# Altium schematic sheet Power (Bridge Rectifier).SchDoc: Bridge Rectifier
size A4; DrawnBy: Mauro De Bruyn; Revision: 1; SheetNumber: 5; SheetTotal: 5; Number: PXL EAI1_2
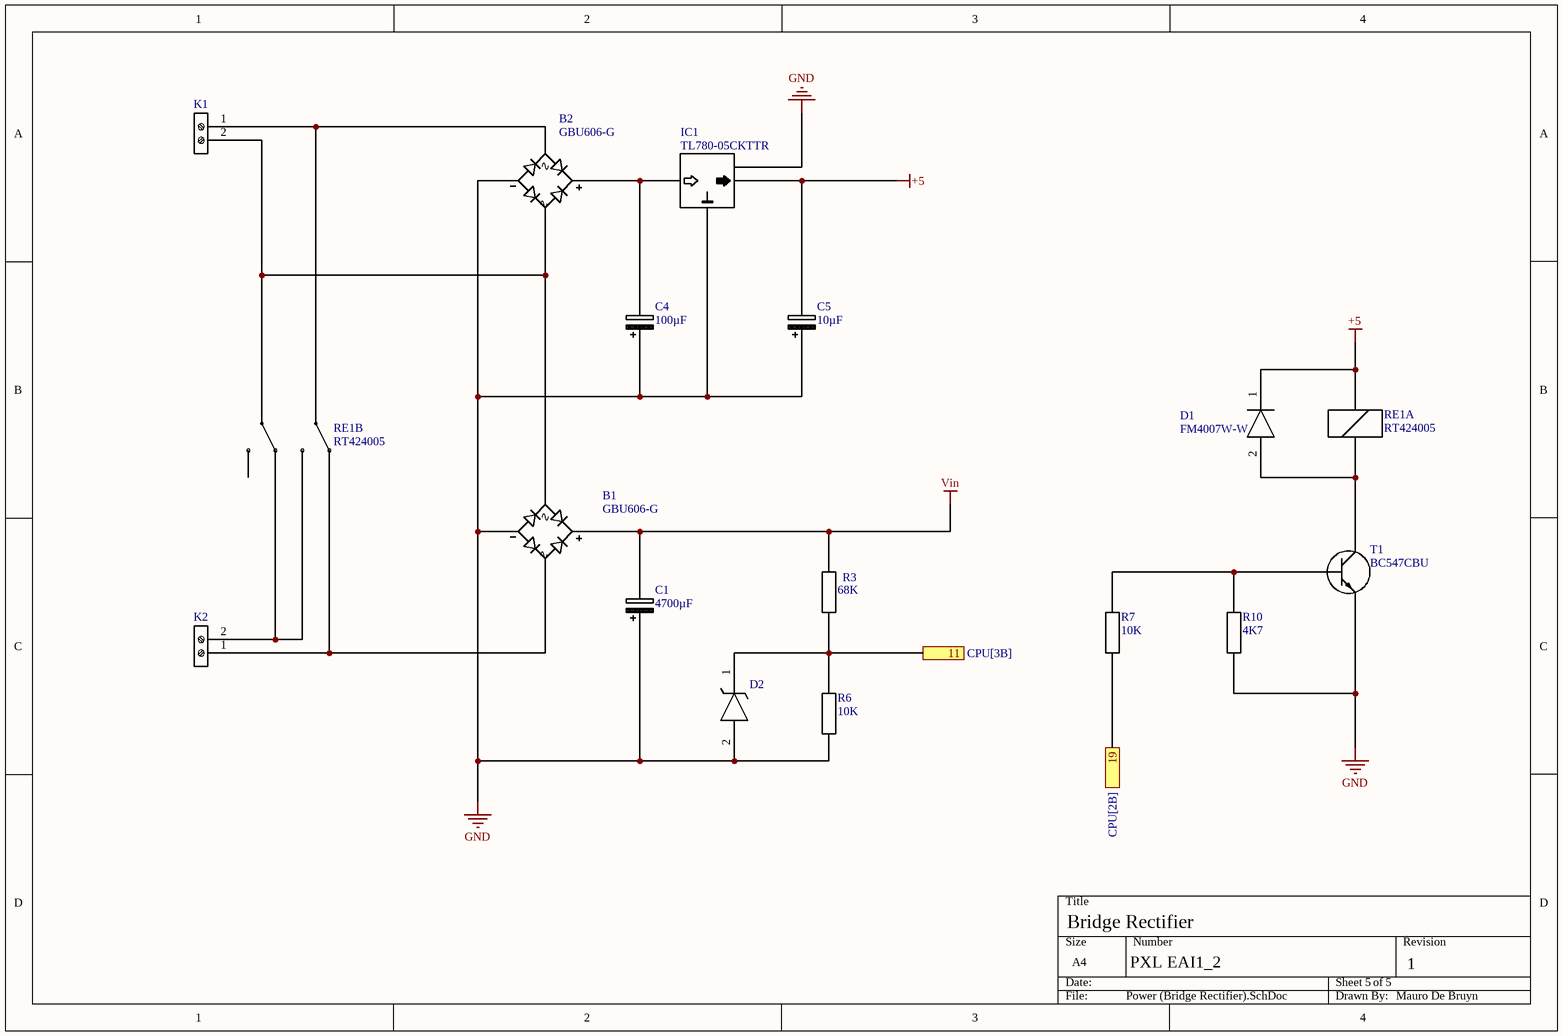
[diagram p0: Power (Bridge Rectifier).SchDoc]

## Parts
B1  GBU606-G  [GBU606G]
B2  GBU606-G  [GBU606G]
C1  4700µF  [CAPPRD750W80D1850H4150]
C4  100µF  [CAPPRD350W60D825H1300]
C5  10µF  [CAPPRD200W52D500H1250]
D1  FM4007W-W  [DIOM5025X231N]
D2  SZMMSZ5231BT1G  [SOD3716X135N]  (value not drawn)
IC1  TL780-05CKTTR  [TL78005CKTTR]
K1  2 Pin Connector 1716020000  [1716020000]  (value not drawn)
K2  2 Pin Connector 1716020000  [1716020000]  (value not drawn)
R3  68K  [0805]
R6  10K  [0805]
R7  10K  [0805]
R10  4K7  [0805]
RE1  RT424005  [RT42]  (parts A,B of 2)
T1  BC547CBU  [BC547CBU]

## Ports
11 (see CPU[3B]), 19 (see CPU[2B])

## Nets
+5: C5.2(-) D1.1(K) IC1.3(OUTPUT) RE1.1(A1_COIL)
GND: B1.4(-) B2.4(-) C1.1(+) C4.1(+) C5.1(+) D2.2(A) IC1.2(COMMON_1) IC1.4(COMMON_2) R6.1 R10.2 T1.3(E)
Vin: B1.1(+) C1.2(-) R3.2
11: D2.1(K) R3.1 R6.2 ; port 11
19: R7.2 ; port 19
NetB1_2: B1.2(~_1) K2.1 RE1.7(22_NC)
NetB1_3: B1.3(~_2) B2.2(~_1) K1.2 RE1.3(11_COM)
NetB2_1: B2.1(+) C4.2(-) IC1.1(INPUT)
NetB2_3: B2.3(~_2) K1.1 RE1.6(21_COM)
NetD1_2: D1.2(A) RE1.8(A2_COIL) T1.1(C)
NetK2_2: K2.2 RE1.2(12_NC) RE1.5(24_NO)
NetR7_1: R7.1 R10.1 T1.2(B)

Not connected (* = marked no-connect by the designer): RE1 4(14_NO)

## Notes on the sheet
- (in symbol GBU606-G) ∿

## Library data of the parts
B1 B2 = GBU606-G: Bridge Rectifier; Manufacturer_Name: Comchip Technology; Datasheet Link: https://www.comchiptech.com/product.php?id=2217; Height: 20.95mm; Manufacturer_Part_Number: GBU606-G
C1 = 50PK4700MEFC18X40: Capacitor Polarised; Manufacturer_Name: Rubycon; Datasheet Link: https://componentsearchengine.com//50PK4700MEFC18X40.pdf; Height: 41.5mm; Mouser2 Part Number: 232-50PK4700MEFC18X4; Mouser2 Price/Stock: https://www.mouser.com/Search/Refine.aspx?Keyword=232-50PK4700MEFC18X4; Manufacturer_Part_Number: 50PK4700MEFC18X40
C4 = RGA101M1HBK-0811G: Capacitor Polarised; Manufacturer_Name: Lelon; Datasheet Link: https://www.arrow.com/en/products/rga101m1hbk-0811g/lelon-electronics; Height: 13mm; Manufacturer_Part_Number: RGA101M1HBK-0811G
C5 = 860020672010: Capacitor Polarised; Manufacturer_Name: Wurth Elektronik; Datasheet Link: https://componentsearchengine.com//860020672010.pdf; Height: 12.5mm; Mouser2 Part Number: 710-860020672010; Mouser2 Price/Stock: https://www.mouser.com/Search/Refine.aspx?Keyword=710-860020672010; Manufacturer_Part_Number: 860020672010
D1 = FM4007W-W: Bridge Rectifier; Manufacturer_Name: Rectron; Datasheet Link: https://componentsearchengine.com//FM4007W-W.pdf; Height: 2.31mm; Mouser2 Part Number: 583-FM4007W-W; Mouser2 Price/Stock: https://www.mouser.com/Search/Refine.aspx?Keyword=583-FM4007W-W; Manufacturer_Part_Number: FM4007W-W
D2 = SZMMSZ5231BT1G: Zener Diode; Manufacturer_Name: onsemi; Datasheet Link: https://www.onsemi.com/pdf/datasheet/mmsz5221bt1-d.pdf; Height: 1.35mm; Manufacturer_Part_Number: SZMMSZ5231BT1G; Mouser Part Number: 863-SZMMSZ5231BT1G; Mouser Price/Stock: https://www.mouser.co.uk/ProductDetail/onsemi/SZMMSZ5231BT1G?qs=tYFd4l%252BlHeQgPMc6zsX19w%3D%3D; Arrow Part Number: SZMMSZ5231BT1G; Arrow Price/Stock: https://www.arrow.com/en/products/szmmsz5231bt1g/on-semiconductor?region=nac
IC1 = TL780-05CKTTR: Integrated Circuit; Manufacturer_Name: Texas Instruments; Datasheet Link: http://www.ti.com/general/docs/suppproductinfo.tsp?distId=26&gotoUrl=http%3A%2F%2Fwww.ti.com%2Flit%2Fgpn%2Ftl780; Height: 5.08mm; Manufacturer_Part_Number: TL780-05CKTTR
K1 K2 = 2 Pin Connector 1716020000: Connector; Manufacturer_Name: Weidmuller; Datasheet Link: https://catalog.weidmueller.com/catalog/Start.do?ObjectID=1716020000&_ga=2.21797499.1716783809.1613378202-511725545.1613378202; Manufacturer_Part_Number: 1716020000
R3 R6 R7 R10 = 0805 (Resistor): Resistor; Manufacturer_Name: Kemet; Manufacturer_Part_Number: C0805C391G3GACTU; Datasheet Link: https://content.kemet.com/datasheets/KEM_C1003_C0G_SMD.pdf; Height: 1.1mm
RE1 = RT424005: Relay or Contactor; Manufacturer_Name: TE Connectivity; Datasheet Link: https://componentsearchengine.com//RT424005.pdf; Mouser2 Part Number: 655-RT424005; Mouser2 Price/Stock: https://www.mouser.com/Search/Refine.aspx?Keyword=655-RT424005; Manufacturer_Part_Number: RT424005
T1 = BC547CBU: Transistor BJT NPN; Manufacturer_Name: ON Semiconductor; Datasheet Link: https://www.onsemi.com/pdf/datasheet/bc550-d.pdf; Height: 5.33mm; Manufacturer_Part_Number: BC547CBU